# EAGLE design amc7135-20mm-RGBW-led-driver-mk-1.0 (EAGLE 7.5.0)
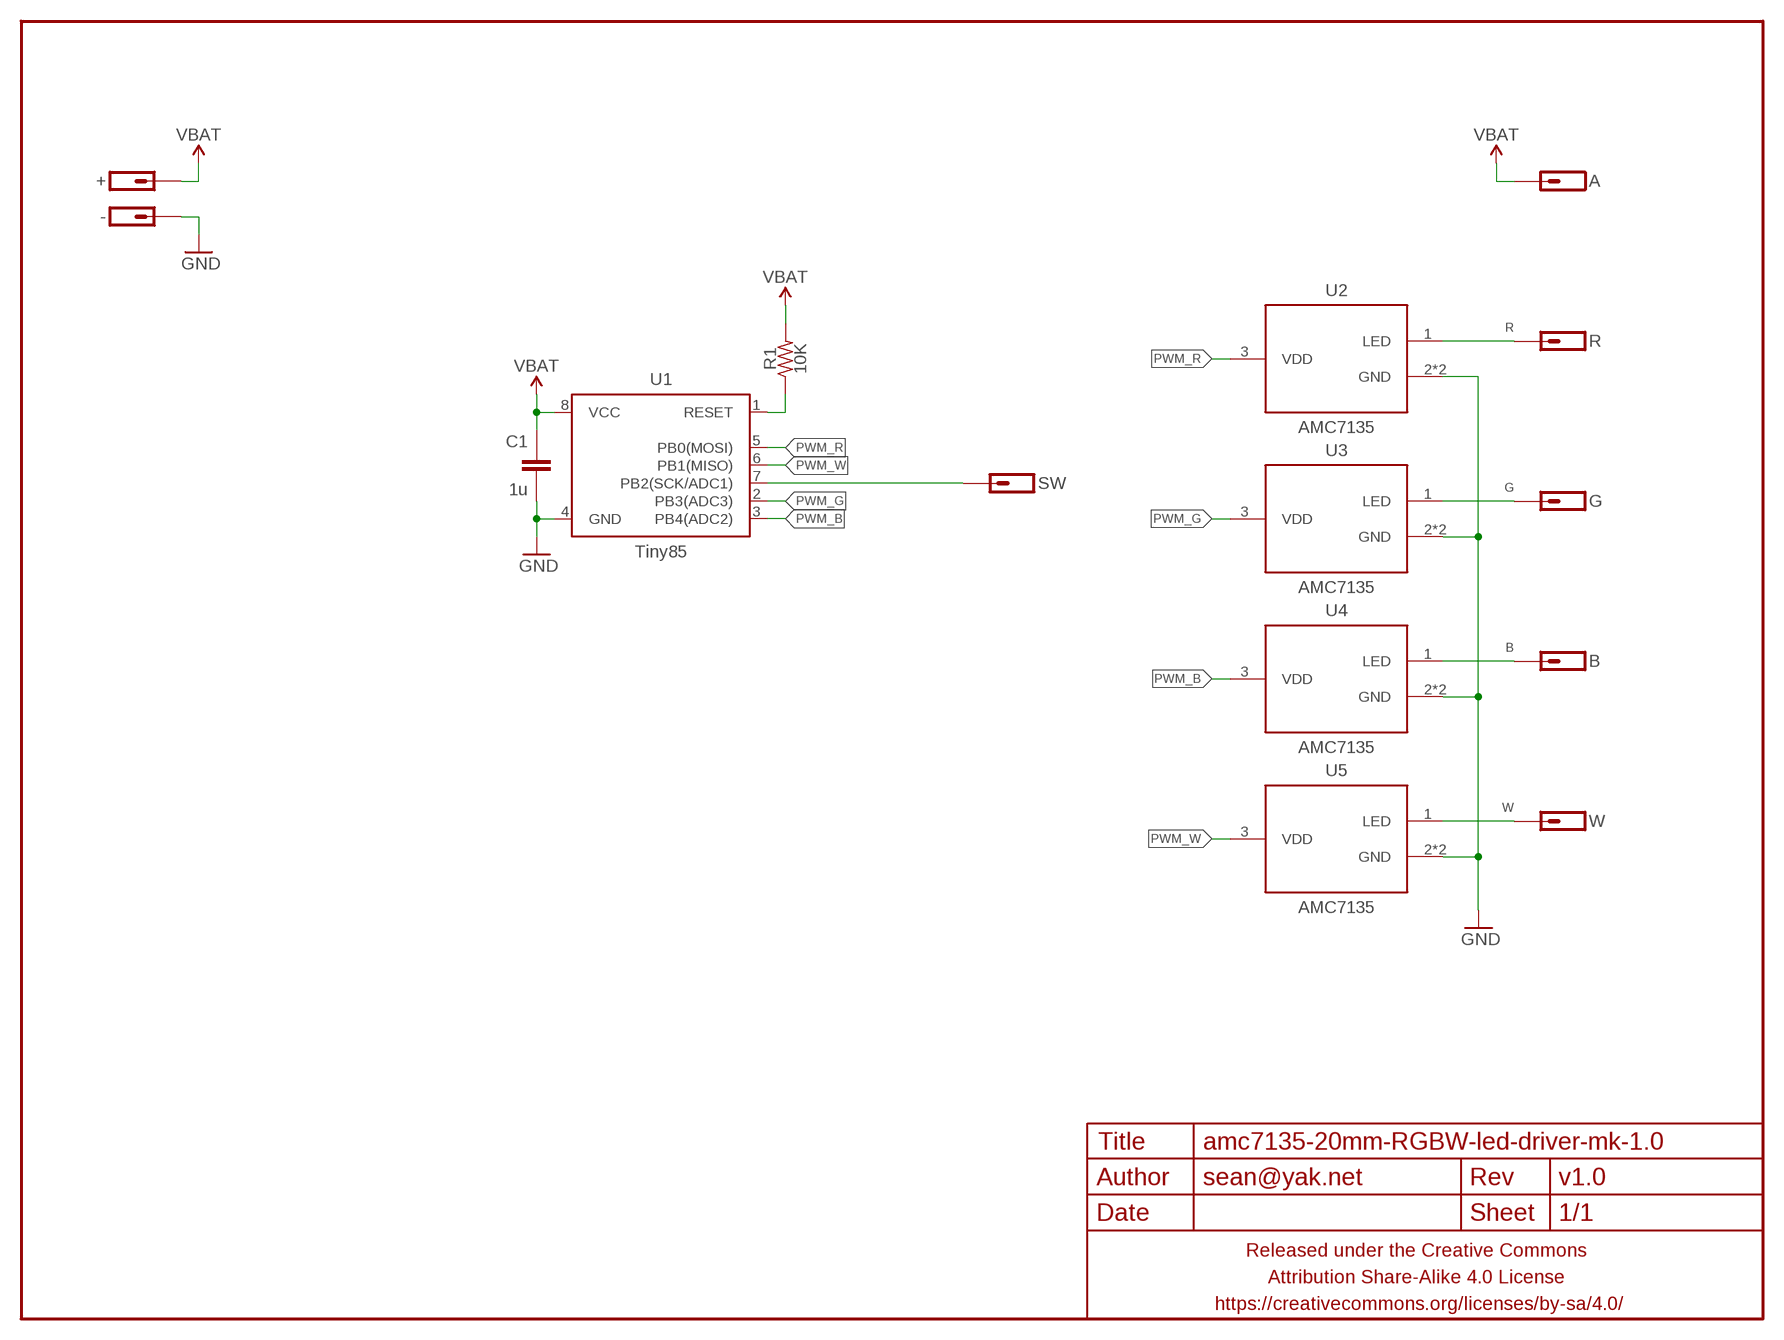
[diagram p0: schematic, sheet 1]

## Parts
+  M01NOSTOP-CANTSTOP-DONTKNOWHOWTOSTOP  [1X01_SMD_NOSTOP_NOSILK]
-  M01NOT-A-VIA-NOPE  [1X01_NOSILK_NOSTOP]
A  M01PTH-1MM-CIR-NS  [1X01-1MM-CIR-NS]
B  M01PTH-1MM-CIR-NS  [1X01-1MM-CIR-NS]
C1  1u  CAPACITOR-CERAMICC0603-TIGHTER  [C0603-TIGHTER]
FRAME1  FRAME-LETTERNO_PACKAGE  [DUMMY]
G  M01PTH-1MM-CIR-NS  [1X01-1MM-CIR-NS]
R  M01PTH-1MM-CIR-NS  [1X01-1MM-CIR-NS]
R1  10K  RESISTORR0603-TIGHTER  [R0603-TIGHTER]
SW  M01PTH-0.8MM  [1X01-0.8MM]
U1  Tiny85  ATTINY45TINY85-20-SOICW  [SO08-EIAJ]
U2  AMC7135  AMC7135SOT-89  [SOT89]
U3  AMC7135  AMC7135SOT-89  [SOT89]
U4  AMC7135  AMC7135SOT-89  [SOT89]
U5  AMC7135  AMC7135SOT-89  [SOT89]
W  M01PTH-1MM-CIR-NS  [1X01-1MM-CIR-NS]

## Nets
B: B.1 U4.1(LED)
G: G.1 U3.1(LED)
GND: -.P$1 C1.2 U1.4(GND) U2.2(GND) U2.4(GND) U3.2(GND) U3.4(GND) U4.2(GND) U4.4(GND) U5.2(GND) U5.4(GND)
N$1: SW.1 U1.7(PB2(SCK/ADC1))
N$4: R1.1 U1.1(RESET)
PWM_B: U1.3(PB4(ADC2)) U4.3(VDD)
PWM_G: U1.2(PB3(ADC3)) U3.3(VDD)
PWM_R: U1.5(PB0(MOSI)) U2.3(VDD)
PWM_W: U1.6(PB1(MISO)) U5.3(VDD)
R: R.1 U2.1(LED)
VBAT: +.1 A.1 C1.1 R1.2 U1.8(VCC)
W: U5.1(LED) W.1

## Library data of the parts
+ - A B G R SW W = a_parts:M01: Header 1 Standard 1-pin 0.1" header. Use with straight break away headers (SKU : PRT-00116), right angle break away headers (PRT-00553), swiss pins (PRT-00743), machine pins (PRT-00117), and female headers (PRT-00115).
C1 = a_parts:CAPACITOR-CERAMIC: CAPACITOR, European symbol
FRAME1 = a_parts:FRAME-LETTER: Schematic Frame Standard 8.5x11 US Letter frame; DESIGNER: sean@yak.net; VERSION: v1.0
R1 = a_parts:RESISTOR: RESISTOR, American symbol
U1 = a_parts:ATTINY45: Atmel 8-pin 2/4/8kB flash uC; PROD_ID: IC-09092; VALUE: Tiny85-20-SMT
U2-U5 = a_parts:AMC7135

## Board
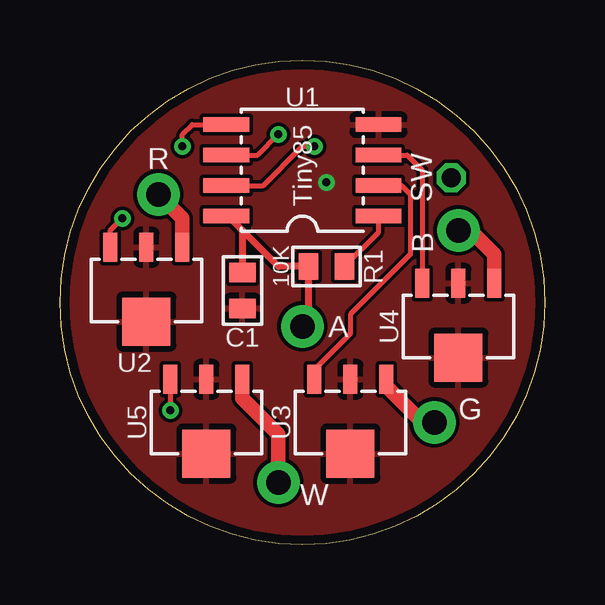
[diagram p1: board, top side]
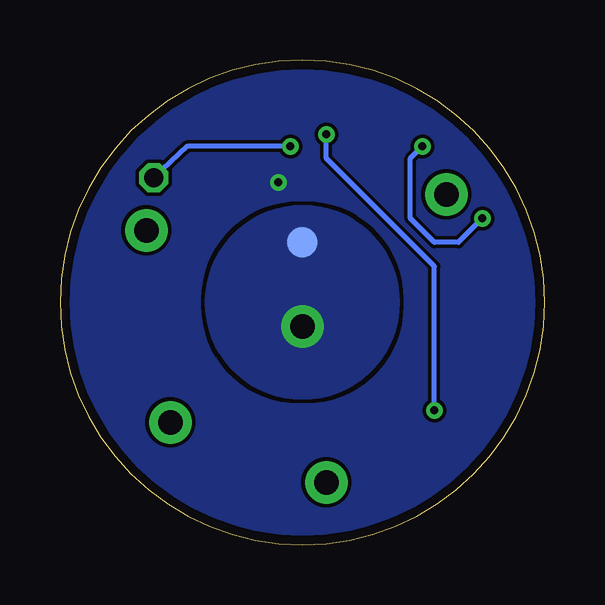
[diagram p2: board, bottom side, seen from below]

Size 20.2 x 20.2 mm. Coordinates in mm from the lower left corner, seen from the top.
Outline: 0,10.1 arc-180 20.2,10.1 arc-180 0,10.1
Copper layers (1*16): Top 0.0356mm / dielectric 1.5011mm / Bottom 0.0356mm
Design rules "LaenPCBOrder2": minimum track width 6mil, minimum drill 13mil, track to track 6mil, track to pad 6mil, pad to pad 6mil, via to via 6mil, smd to smd 6mil, copper to edge 15mil, drill to drill 6mil, minimum pad ring 7mil, minimum via ring 7mil, stop-mask expansion 3mil, vias tented up to drill 20mil, thermal gap 10mil
tKeepout: area 0,0 to 20.2,20.2

### Footprints (pad centres in the part's own frame; a part is rotated, then mirrored left to right if it is on the bottom)
1X01_SMD_NOSTOP_NOSILK = smd 1.27 x 1.27: 1 0,0
1X01_NOSILK_NOSTOP = drill 0.33: P$1 0,0
1X01-1MM-CIR-NS = drill 1.016 pad 1.778: 1 0,0
C0603-TIGHTER = smd 0.8 x 1.1: 1 -0.75,0; 2 0.75,0
R0603-TIGHTER = smd 0.8 x 1.1: 1 -0.75,0; 2 0.75,0
1X01-0.8MM = drill 0.8 octagon: 1 0,0
SO08-EIAJ = smd 0.61 x 1.905: 1 -1.905,-3.175; 2 -0.635,-3.175; 3 0.635,-3.175; 4 1.905,-3.175; 5 1.905,3.175; 6 0.635,3.175; 7 -0.635,3.175; 8 -1.905,3.175
SOT89 = smd 0.58 x 1.2: 1 -1.5,-1.8; 2 0,-1.8; 3 1.5,-1.8 | smd 2 x 2: 4 0,1.3

### Placement (x,y rotation side)
+  10.1,12.6 270 bottom
-  11.1,15.1 90 bottom
A  10.1,9.1 90 top
B  16.6,13.1 180 top
C1  7.6,10.6 270 top
FRAME1  0.1,0.1 0 top
G  15.6,5.1 90 top
R  4.1,14.6 0 top
R1  11.1,11.6 180 top
SW  16.3,15.3 0 top
U1  10.1,15.6 90 top
U2  3.6,10.6 180 top
U3  12.1,5.1 180 top
U4  16.6,9.1 180 top
U5  6.1,5.1 180 top
W  9.1,2.6 270 top

### Tracks (layer width: path | path; a pad name or v marks a point on that pad's centre or on a via)
B
  Top 0.6: U4.1 18.1,12.1 17.1,13.1 B.1
G
  Top 0.6: U3.1 13.6,6.6 15.1,5.1 G.1
GND
  pour Bottom (rank 6): 0,10.1 0,10.05 arc90 10.05,0 arc90 20.15,10.05 20.15,10.1 arc90 10.1,20.2 arc90
  pour Top (rank 6): 0,10.1 0,10.05 arc90 10.05,0 arc90 20.15,10.05 20.15,10.1 arc90 10.1,20.2 arc90
N$1  (via drill 0.33)
  Top 0.2: U1.7 8.46,14.97 10.1,16.6 v10.6,16.6
  Bottom 0.2: v10.6,16.6 14.9,16.6 SW.1
N$4
  Top 0.2: R1.1 13.28,13.03 U1.1
PWM_B
  Top 0.2: U1.3 14.46,16.24 15.1,15.6 U4.3
PWM_G
  Top 0.2: U1.2 14.23,14.97 14.6,14.6 14.6,12.1 12.1,9.6 12.1,8.8 10.6,7.3 U3.3
PWM_R  (via drill 0.33)
  Top 0.2: U2.3 2.1,13.1 v2.6,13.6 | v5.1,16.6 5.1,17.1 5.5,17.51 U1.5
  Bottom 0.2: v2.6,13.6 3.6,12.6 4.6,12.6 5.6,13.6 5.6,16.1 v5.1,16.6
PWM_W  (via drill 0.33)
  Top 0.2: U5.3 v4.6,5.6 | U1.6 8.23,16.24 v9.1,17.1
  Bottom 0.2: v4.6,5.6 4.6,11.6 9.1,16.1 v9.1,17.1
R
  Top 0.6: U2.1 5.1,13.6 R.1
VBAT
  Top 0.3: U1.8 7,13.7 7.6,13.1 | 7.6,13.1 C1.1 | 7.6,13.1 9.1,11.6 R1.2 10.35,9.35 A.1
  pour Bottom (no thermals): 10.1,6.1 arc-90 6.1,10.1 arc-90 10.1,14.1 arc-90 14.1,10.1 arc-90
W
  Top 0.6: U5.1 7.6,6.1 9.1,4.6 W.1